# Altium schematic sheet B293A PSU.SchDoc: Power Supply
size A3; DocumentNumber: 293; Revision: A; PageSetup: Record=PageOptions|CenterHorizontal=True|CenterVertical=True|PrintScale=0.09|XCorrection=1.00|YCorrection=1.00|PrintKind=1|BorderSize=5000000|LeftOffset=0|BottomOffset=0|Orientation=2|PaperLength=1000|PaperWidth=1000|Scale=100|PaperSource=7|PrintQuality=-4|MediaType=1|DitherType=10|PaperKind=A3|PrintScaleMode=1
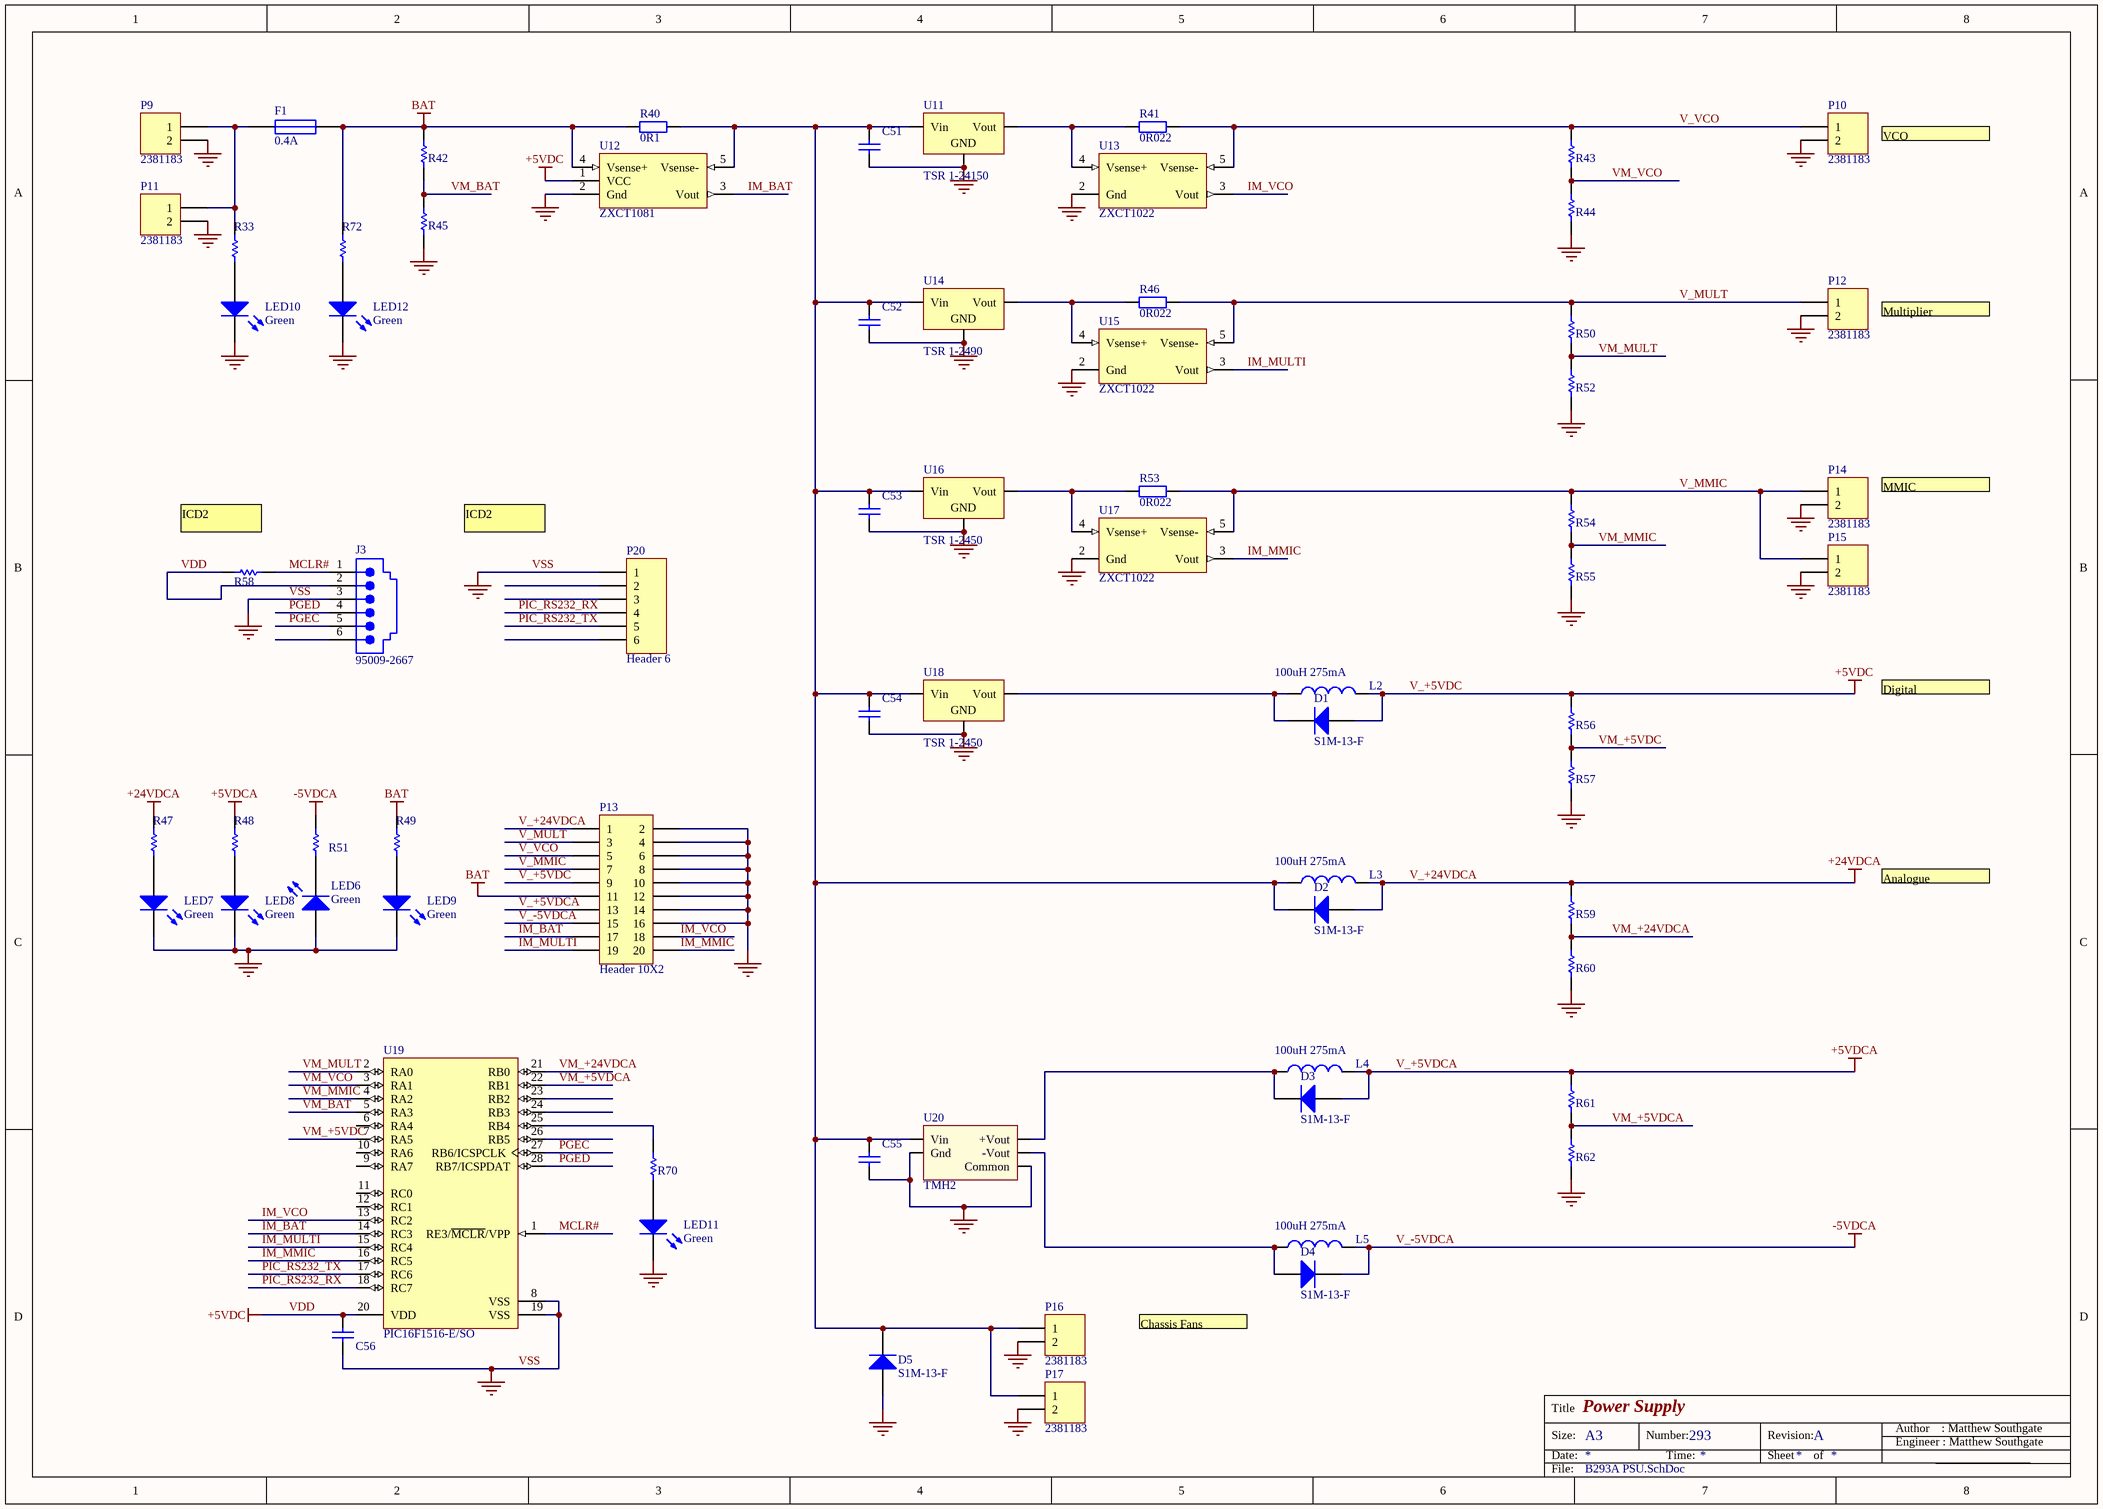
[diagram p0: B293A PSU.SchDoc]

## Parts
C51  CAP 10uF 25V 0805(2012)  [CAPC0805(2012)145_N]  (value not drawn)
C52  CAP 10uF 25V 0805(2012)  [CAPC0805(2012)145_N]  (value not drawn)
C53  CAP 10uF 25V 0805(2012)  [CAPC0805(2012)145_N]  (value not drawn)
C54  CAP 10uF 25V 0805(2012)  [CAPC0805(2012)145_N]  (value not drawn)
C55  CAP 10uF 25V 0805(2012)  [CAPC0805(2012)145_N]  (value not drawn)
C56  CAP 100nF 50V 0805(2012)  [CAPC0805(2012)100_M]  (value not drawn)
D1  S1M-13-F  [DIOD-S1M-13-F-SMA-2_V]
D2  S1M-13-F  [DIOD-S1M-13-F-SMA-2_V]
D3  S1M-13-F  [DIOD-S1M-13-F-SMA-2_V]
D4  S1M-13-F  [DIOD-S1M-13-F-SMA-2_V]
D5  S1M-13-F  [DIOD-S1M-13-F-SMA-2_V]
F1  0.4A  [RXEF040]
J3  95009-2667  [95009-2667]
L2  100uH 275mA  [AXIAL-0.4]
L3  100uH 275mA  [AXIAL-0.4]
L4  100uH 275mA  [AXIAL-0.4]
L5  100uH 275mA  [AXIAL-0.4]
LED6  Green  [1206 - LED]
LED7  Green  [1206 - LED]
LED8  Green  [1206 - LED]
LED9  Green  [1206 - LED]
LED10  Green  [1206 - LED]
LED11  Green  [1206 - LED]
LED12  Green  [1206 - LED]
P9  Supplier Part Number 1: 2381183  [MOLEX SL 2W Vertical with latch]  (hidden comment: MOLEX SL 2W VERT)
P10  Supplier Part Number 1: 2381183  [MOLEX SL 2W Vertical with latch]  (hidden comment: MOLEX SL 2W VERT)
P11  Supplier Part Number 1: 2381183  [MOLEX SL 2W Vertical with latch]  (hidden comment: MOLEX SL 2W VERT)
P12  Supplier Part Number 1: 2381183  [MOLEX SL 2W Vertical with latch]  (hidden comment: MOLEX SL 2W VERT)
P13  Header 10X2  [HDR2X10]
P14  Supplier Part Number 1: 2381183  [MOLEX SL 2W Vertical with latch]  (hidden comment: MOLEX SL 2W VERT)
P15  Supplier Part Number 1: 2381183  [MOLEX SL 2W Vertical with latch]  (hidden comment: MOLEX SL 2W VERT)
P16  Supplier Part Number 1: 2381183  [MOLEX SL 2W Vertical with latch]  (hidden comment: MOLEX SL 2W VERT)
P17  Supplier Part Number 1: 2381183  [MOLEX SL 2W Vertical with latch]  (hidden comment: MOLEX SL 2W VERT)
P20  Header 6  [HDR1X6]
R33  10K 5% 0805(2012)  [RESC0805(2012)_L]  (value not drawn)
R40  0R1  [1206]
R41  0R022  [1206]
R42  1K 5% 0805(2012)  [RESC0805(2012)_N]  (value not drawn)
R43  1K 5% 0805(2012)  [RESC0805(2012)_N]  (value not drawn)
R44  390R 5% 0805(2012)  [RESC0805(2012)_N]  (value not drawn)
R45  220R 5% 0805(2012)  [RESC0805(2012)_L]  (value not drawn)
R46  0R022  [1206]
R47  6K8 5% 0805(2012)  [RESC0805(2012)_L]  (value not drawn)
R48  1K 5% 0805(2012)  [RESC0805(2012)_N]  (value not drawn)
R49  10K 5% 0805(2012)  [RESC0805(2012)_L]  (value not drawn)
R50  1K 5% 0805(2012)  [RESC0805(2012)_N]  (value not drawn)
R51  1K 5% 0805(2012)  [RESC0805(2012)_N]  (value not drawn)
R52  1K 5% 0805(2012)  [RESC0805(2012)_N]  (value not drawn)
R53  0R022  [1206]
R54  1K 5% 0805(2012)  [RESC0805(2012)_N]  (value not drawn)
R55  10K 5% 0805(2012)  [RESC0805(2012)_L]  (value not drawn)
R56  1K 5% 0805(2012)  [RESC0805(2012)_N]  (value not drawn)
R57  10K 5% 0805(2012)  [RESC0805(2012)_L]  (value not drawn)
R58  10K 5% 0805(2012)  [RESC0805(2012)_L]  (value not drawn)
R59  1K 5% 0805(2012)  [RESC0805(2012)_N]  (value not drawn)
R60  220R 5% 0805(2012)  [RESC0805(2012)_L]  (value not drawn)
R61  1K 5% 0805(2012)  [RESC0805(2012)_N]  (value not drawn)
R62  10K 5% 0805(2012)  [RESC0805(2012)_L]  (value not drawn)
R70  1K 5% 0805(2012)  [RESC0805(2012)_N]  (value not drawn)
R72  10K 5% 0805(2012)  [RESC0805(2012)_L]  (value not drawn)
U11  TSR 1-24150  [TSR-1 Series]
U12  ZXCT1081  [SOT23-5]
U13  ZXCT1022  [SOT23-5]
U14  TSR 1-2490  [TSR-1 Series]
U15  ZXCT1022  [SOT23-5]
U16  TSR 1-2450  [TSR-1 Series]
U17  ZXCT1022  [SOT23-5]
U18  TSR 1-2450  [TSR-1 Series]
U19  PIC16F1516-E/SO  [MCHP-SOIC-SO28_N]
U20  TMH2  [TMH2 Dual output]

## Nets
BAT: F1.2 P13.11 R40.2 R42.2 R49.2 R72.2 U12.4(Vsense+)
V_+5VDC: C56.1 D1.1(A) J3.2 L2.2 P13.9 R56.2 R58.1 U12.1(VCC) U19.20(VDD)  [also labelled +5VDC, VDD]
V_+5VDCA: D3.1(A) L4.2 P13.13 R48.2 R61.2  [also labelled +5VDCA]
V_+24VDCA: D2.1(A) L3.2 P13.1 R47.2 R59.2  [also labelled +24VDCA]
V_-5VDCA: D4.2(K) L5.2 P13.15 R51.1  [also labelled -5VDCA]
VSS: C51.1 C52.1 C53.1 C54.1 C55.1 C56.2 D5.1(A) J3.3 LED6.A LED7.K LED8.K LED9.K LED10.K LED11.K LED12.K P9.2 P10.2 P11.2 P12.2 P13.2 P13.4 P13.6 P13.8 P13.10 P13.12 P13.14 P13.16 P14.2 P15.2 P16.2 P17.2 P20.1 R44.1 R45.1 R52.1 R55.1 R57.1 R60.1 R62.1 U11.2(GND) U12.2(Gnd) U13.2(Gnd) U14.2(GND) U15.2(Gnd) U16.2(GND) U17.2(Gnd) U18.2(GND) U19.8(VSS) U19.19(VSS) U20.2(Gnd) U20.5(Common)  [also labelled GND]
IM_BAT: P13.17 U12.3(Vout) U19.14(RC3)
IM_MMIC: P13.20 U17.3(Vout) U19.16(RC5)
IM_MULTI: P13.19 U15.3(Vout) U19.15(RC4)
IM_VCO: P13.18 U13.3(Vout) U19.13(RC2)
MCLR#: J3.1 R58.2 U19.1(RE3/~{MCLR}/VPP)
PGEC: J3.5 U19.27(RB6/ICSPCLK)
PGED: J3.4 U19.28(RB7/ICSPDAT)
PIC_RS232_RX: P20.4 U19.18(RC7)
PIC_RS232_TX: P20.5 U19.17(RC6)
V_MMIC: P13.7 P14.1 P15.1 R53.2 R54.2 U17.5(Vsense-)
V_MULT: P12.1 P13.3 R46.2 R50.2 U15.5(Vsense-)
V_VCO: P10.1 P13.5 R41.2 R43.2 U13.5(Vsense-)
VM_+5VDC: R56.1 R57.2 U19.7(RA5)
VM_+5VDCA: R61.1 R62.2 U19.22(RB1)
VM_+24VDCA: R59.1 R60.2 U19.21(RB0)
VM_BAT: R42.1 R45.2 U19.5(RA3)
VM_MMIC: R54.1 R55.2 U19.4(RA2)
VM_MULT: R50.1 R52.2 U19.2(RA0)
VM_VCO: R43.1 R44.2 U19.3(RA1)
NetC51_2: C51.2 C52.2 C53.2 C54.2 C55.2 D2.2(K) D5.2(K) L3.1 P16.1 P17.1 R40.1 U11.1(Vin) U12.5(Vsense-) U14.1(Vin) U16.1(Vin) U18.1(Vin) U20.1(Vin)
NetD1_2: D1.2(K) L2.1 U18.3(Vout)
NetD3_2: D3.2(K) L4.1 U20.6(+Vout)
NetD4_1: D4.1(A) L5.1 U20.4(-Vout)
NetF1_1: F1.1 P9.1 P11.1 R33.2
NetLED6_K: LED6.K R51.2
NetLED7_A: LED7.A R47.1
NetLED8_A: LED8.A R48.1
NetLED9_A: LED9.A R49.1
NetLED10_A: LED10.A R33.1
NetLED11_A: LED11.A R70.1
NetLED12_A: LED12.A R72.1
NetR41_1: R41.1 U11.3(Vout) U13.4(Vsense+)
NetR46_1: R46.1 U14.3(Vout) U15.4(Vsense+)
NetR53_1: R53.1 U16.3(Vout) U17.4(Vsense+)
NetR70_2: R70.2 U19.25(RB4)

Not connected (* = marked no-connect by the designer): J3 6; P20 2 3 6; U19 6(RA4) 9(RA7) 10(RA6) 11(RC0) 12(RC1) 23(RB2) 24(RB3) 26(RB5)

## Notes on the sheet
- VCO
- Multiplier
- MMIC
- (near R58) ICD2
- ICD2
- Digital
- Analogue
- Chassis Fans
- Title
- Size:
- Date:
- A3
- Number:
- Time:
- Revision:
- Sheet
- of
- Engineer : Matthew Southgate
- Author    : Matthew Southgate
- File:

## Library data of the parts
C51-C55 = CMP-1036-04933-1: CAP 10uF 25V ±20% 0805 (2012 Metric) Thickness 1.45mm SMD; Case-EIA: 0805; Case-Metric: 2012; Technology: SMT; Tolerance: ±20%; Max Thickness: 1.45 mm; Value: 10uF; Rated Voltage: 25 V
C56 = CMP-1036-04423-1: CAP 100nF 50V ±20% 0805 (2012 Metric) Thickness 1mm SMD; Case-Metric: 2012; Case-EIA: 0805; Value: 100nF; Max Thickness: 1 mm; Rated Voltage: 50 V; Tolerance: ±20%; Technology: SMT
D1-D5 = CMP-0639-00001-1: Surface Mount Glass Passivated Rectifier, 1000V, 1 A, -65 to 125 degC, 2-Pin SMA Package, RoHS, Tape and Reel; Manufacturer: Diodes Inc; DatasheetVersion: Rev. 22 - 2; PackageReference: S1M-13-F-SMA-2; PackageDescription: 2-Pin SMD, Body 4.3 x 2.605 mm, Height 2.3 mm; ComponentLink1Description: Manufacturer URL; ComponentLink1URL: http://www.diodes.com/; ComponentLink2Description: Datasheet; ComponentLink2URL: http://diodes.com/datasheets/ds16003.pdf; ComponentLink3URL: http://diodes.com/datasheets/ds16003.pdf; ComponentLink3Description: Package Specification; Mounting Technology: Surface Mount; RoHS: TRUE; Packing: Tape and Reel; PackageVersion: Rev. 22 - 2; PartNumber: S1M-13-F
F1 = Fuse Poly 0.4A: POLYSWITCH, RADIAL, 0.4A; Manufacturer: TE CONNECTIVITY / RAYCHEM; Description: TE CONNECTIVITY / RAYCHEM - RXEF040 - POLYSWITCH, RADIAL, 0.4A; Holding Current: 400; Tripping Current: 800; Initial Resistance Max: 0.86; Operating Voltage: 72; PTC Fuse Case: Radial Leaded; Supplier: Farnell; Supplier Order Code: 1175862; Manufacturer Part Number: RXEF040; Supplier 1: Farnell; Supplier Part Number 1: 1175862; RoHS: YES; Stock 1: 8252; Pricing 1: 5=0.31, 50=0.25, 100=0.197, 250=0.187, 500=0.139, 1000=0.129 (GBP); ComponentLink1URL: http://www.farnell.com/datasheets/1482689.pdf; ComponentLink1Description: http://www.farnell.com/datasheets/1482689.pdf; Supplier 2: Newark; Supplier Part Number 2: 04H8116; Stock 2: 1314; Pricing 2: 1=0.388, 10=0.366, 100=0.332, 500=0.259, 1000=0.223, 5000=0.205, 10000=0.173, 50000=0.166 (USD); Series: RXE; Fuse Terminals: Radial Leaded; Lead Spacing: 5.8; ComponentLink2URL: http://www.te.com/commerce/DocumentDelivery/DDEController?Action=showdoc&DocId=Catalog+Section%7FRADIAL-LEADED%7FA%7Fpdf%7FEnglish%7FENG_CS_RADIAL-LEADED_A.pdf%7FRF0417-000; ComponentLink2Description: http://www.te.com/commerce/DocumentDelivery/DDEController?Action=showdoc&DocId=Catalog+Section%7FRADIAL-LEADED%7FA%7Fpdf%7FEnglish%7FENG_CS_RADIAL-LEADED_A.pdf%7FRF0417-000
J3 = 95009-2667: Right Angle, Standard Profile, Flush Mount PCB Jack; Manufacturer: MOLEX; Ports: 1; Positions/Loaded: Port1 - 6/6; PerformanceCategory: 3; PCB_Mounting: Thru-Hole; DrillSize: Nominal, Rounded to nearest 0.05mm; PCB_Layout: Complies with Manufacturer's Recommendation.; Description: MOLEX - 95009-2667 - JACK PLUG; Published: 25-Jun-2002; DatasheetDocument: 18-Dec-2001; PackageDocument: 18-Dec-2001; PackageReference: 95009-2667; Publisher: Altium Limited; ComponentLink1Description: Manufacturer Link; ComponentLink1URL: http://www.molex.com/; Supplier 1: Farnell; Supplier Part Number 1: 1393306; Manufacturer Part Number: 95009-2667; RoHS: YES; Stock 1: 159; Pricing 1: 5=0.85, 100=0.52, 250=0.42, 500=0.41, 1000=0.38, 2500=0.34, 2500=0.306, 20000=0.275 (GBP); ComponentLink2URL: http://www.farnell.com/cad/1597831.pdf; ComponentLink2Description: http://www.farnell.com/cad/1597831.pdf; ComponentLink3URL: http://www.farnell.com/datasheets/1627656.pdf; ComponentLink3Description: http://www.farnell.com/datasheets/1627656.pdf; Supplier 2: Newark; Supplier Part Number 2: 60H6049; Stock 2: 0; ComponentLink4URL: http://www.farnell.com/datasheets/1025072.pdf; ComponentLink4Description: http://www.farnell.com/datasheets/1025072.pdf; ComponentLink5URL: http://www.molex.com/pdm_docs/sd/950092667_sd.pdf; ComponentLink5Description: http://www.molex.com/pdm_docs/sd/950092667_sd.pdf
L2-L5 = Inductor: Power Inductor; Manufacturer Part Number: MCAL0410A1-101KU; Manufacturer: MULTICOMP; Order Code: 1864497; Fitted: Yes; RoHS Compliant: TRUE; Supplier: Farnell
LED6-LED12 = LED 1206 GREEN: LED, SMD, 1206, CLR LENS, GREEN; Manufacturer Part Number: KPC-3216SGC; Manufacturer: KINGBRIGHT; Order Code: 1318254; Supplier: Farnell; Supplier 1: Farnell; RoHS: YES; Stock 1: 798; Pricing 1: 10=0.2, 50=0.169, 100=0.146, 250=0.126, 500=0.119, 1000=0.107, 1000=0.0964, 8000=0.0868 (GBP); ComponentLink1URL: http://www.us.kingbright.com/images/catalog/SPEC/APC3216SGC.pdf; ComponentLink1Description: http://www.us.kingbright.com/images/catalog/SPEC/APC3216SGC.pdf; Supplier Part Number 1: 1318254
P9-P12 P14-P17 = MOLEX SL 2W VERT: MOLEX - 70543-0106 - CONNECTOR, HEADER, 2POS, 1ROW, 2.54MM; Product Range: MOLEX - SL 70543 Series; Contact Termination: Through Hole Vertical; No. of Contacts: 2; No. of Rows: 1; Pitch Spacing: 2.54; Supplier: Farnell; Order Code: 2381183; Manufacturer Part Number: 70543-0106; Supplier 1: Farnell; Manufacturer: MOLEX; RoHS: YES; Stock 1: 3355; Pricing 1: 5=0.414, 10=0.373, 100=0.336, 500=0.302, 1000=0.272, 2500=0.245 (GBP); Gender: Header; Contact Plating: Gold; Contact Material: Phosphor Bronze<!--FANDB--><div class="features-and-benefits-container"></div>; ComponentLink1URL: http://www.farnell.com/cad/1728429.pdf; ComponentLink1Description: http://www.farnell.com/cad/1728429.pdf
P13 = Header 10X2: Header, 10-Pin, Dual row; LatestRevisionDate: 17-Jul-2002; LatestRevisionNote: Re-released for DXP Platform.; Publisher: Altium Limited
P20 = Header 6: Header, 6-Pin; LatestRevisionDate: 17-Jul-2002; LatestRevisionNote: Re-released for DXP Platform.; Publisher: Altium Limited
R33 R49 R55 R57 R58 R62 R72 = CMP-1013-00098-1: 10K 0.125W 5% 0805 (2012 Metric)  SMD; Case-Metric: 2012; Value: 10000.00 Ohm; Case-EIA: 0805; Technology: SMT; Tolerance: 5 %; Power: 0.125 W
R40 = RES_0R1: RESISTOR, THICK, 0.1OHM, 0.25W, 1%, 1206; Manufacturer Part Number: CRL1206-FW-R100ELF; Order Code: 2008301; Supplier: Farnell
R41 R46 R53 = RES_0R022: RESISTOR, CURRENT SENSE, 0R022, 0.5W, 1%; Manufacturer: MULTICOMP; Manufacturer Part Number: MCCSM06FTDUR022; Order Code: 2294085; Description: MULTICOMP - MCCSM06FTDUR022 - RESISTOR, CURRENT SENSE, 0R022, 0.5W, 1%; Supplier: Farnell; Supplier 1: Farnell; Supplier Part Number 1: 2294085; RoHS: YES; Stock 1: 4260; Pricing 1: 10=0.165, 50=0.136, 100=0.125, 500=0.113, 1000=0.102 (GBP); ComponentLink1URL: http://www.farnell.com/datasheets/1691440.pdf; ComponentLink1Description: http://www.farnell.com/datasheets/1691440.pdf
R42 R43 R48 R50-R52 R54 R56 R59 R61 R70 = CMP-1013-00074-1: 1K 0.125W 5% 0805 (2012 Metric)  SMD; Case-Metric: 2012; Case-EIA: 0805; Value: 1000.00 Ohm; Power: 0.125 W; Tolerance: 5 %; Technology: SMT
R44 = CMP-1013-00064-1: 390R 0.125W 5% 0805 (2012 Metric)  SMD; Case-EIA: 0805; Value: 390.00 Ohm; Case-Metric: 2012; Technology: SMT; Tolerance: 5 %; Power: 0.125 W
R45 R60 = CMP-1013-00058-1: 220R 0.125W 5% 0805 (2012 Metric)  SMD; Value: 220.00 Ohm; Case-EIA: 0805; Case-Metric: 2012; Tolerance: 5 %; Technology: SMT; Power: 0.125 W
R47 = CMP-1013-00094-1: 6K8 0.125W 5% 0805 (2012 Metric)  SMD; Value: 6800.00 Ohm; Case-EIA: 0805; Case-Metric: 2012; Power: 0.125 W; Technology: SMT; Tolerance: 5 %
U11 = TSR-1 Series DC-DC 15V: CONVERTER, DC TO DC, 24V TO 15V, 15W; Manufacturer: TRACOPOWER; Order Code: 1672131; Description: TRACOPOWER - TSR 1-24150 - CONVERTER, DC TO DC, 24V TO 15V, 15W; DC / DC Converter Type: Non Isolated POL; DC / DC Converter Mounting: Through Hole; Input Voltage DC Min: 18; Input Voltage DC Max: 36; No. of Outputs: 1; Output Voltage Nom.: 15; DC / DC Converter Output Type: Fixed<!--FANDB--><div class="features-and-benefits-container"></div>; Supplier: Farnell; Supplier 1: Farnell; Supplier Part Number 1: 1672131; Manufacturer Part Number: TSR 1-24150; RoHS: YES; Stock 1: 405; Pricing 1: 1=6.6, 5=6.4, 10=6.21, 25=6.02 (GBP); Output Current Max: 1; Output Power Max: 15; Depth: 11.7; Width: 7.6; Height: 10.2; Approvals / Standards: -; ComponentLink1URL: http://www.farnell.com/datasheets/1537625.pdf; ComponentLink1Description: http://www.farnell.com/datasheets/1537625.pdf; ComponentLink2URL: http://www.farnell.com/datasheets/1763604.pdf; ComponentLink2Description: http://www.farnell.com/datasheets/1763604.pdf; ComponentLink3URL: http://www.tracopower.com/fileadmin/medien/dokumente/pdf/datasheets/tsr1.pdf; ComponentLink3Description: http://www.tracopower.com/fileadmin/medien/dokumente/pdf/datasheets/tsr1.pdf
U12 = ZXCT1081: CURRENT MONITOR, PRECISION, 40V; Mancufacturer Part Number: ZXCT1081E5TA; Manufacturer: DIODES INC.; Order Code: 1461568; Description: DIODES INC. - ZXCT1081E5TA - CURRENT MONITOR, PRECISION, 40V; Supplier: Farnell; Supplier 1: Farnell; Supplier Part Number 1: 1461568; Manufacturer Part Number: ZXCT1081E5TA; RoHS: YES; Stock 1: 4400; Pricing 1: 1=1.1, 10=0.8, 100=0.7, 250=0.62, 500=0.419, 2000=0.415, 2000=0.407, 10000=0.399 (GBP); ComponentLink1URL: http://www.farnell.com/datasheets/5927.pdf; ComponentLink1Description: http://www.farnell.com/datasheets/5927.pdf
U13 U15 U17 = ZXCT1022: Manufacturer: DIODES INC.; Manufacturer Part Number: ZXCT1022E5TA; Description: DIODES INC. - ZXCT1022E5TA - CURRENT MONITOR, HIGH SIDE, 1022; Supplier 1: Farnell; Supplier Part Number 1: 1461563; RoHS: YES; Stock 1: 1028; Pricing 1: 1=0.87, 10=0.66, 100=0.54, 250=0.52, 500=0.49, 2000=0.373, 2000=0.366, 20000=0.359 (GBP); ComponentLink1URL: http://www.farnell.com/datasheets/5923.pdf; ComponentLink1Description: http://www.farnell.com/datasheets/5923.pdf
U14 = TSR-1 Series DC-DC 9V: DC/DC CONVERTER, 9V, 1A,; Manufacturer: TRACOPOWER; Order Code: 1696322; Description: TRACOPOWER - TSR 1-2490 - DC/DC CONVERTER, 9V, 1A, STEP DOWN; Supplier: Farnell; Supplier 1: Farnell; Supplier Part Number 1: 1696322; Manufacturer Part Number: TSR 1-2490; RoHS: YES; Stock 1: 864; Pricing 1: 1=6.6, 5=6.4, 10=6.21, 25=6.02 (GBP); ComponentLink1URL: http://www.farnell.com/datasheets/1537625.pdf; ComponentLink1Description: http://www.farnell.com/datasheets/1537625.pdf; ComponentLink2URL: http://www.farnell.com/datasheets/1763604.pdf; ComponentLink2Description: http://www.farnell.com/datasheets/1763604.pdf; ComponentLink3URL: http://www.tracopower.com/fileadmin/medien/dokumente/pdf/datasheets/tsr1.pdf; ComponentLink3Description: http://www.tracopower.com/fileadmin/medien/dokumente/pdf/datasheets/tsr1.pdf; Supplier 2: Newark; Supplier Part Number 2: 86P6890; Stock 2: 0; Pricing 2: 1=13.24, 5=12.73, 10=12.38, 25=11.81, 50=11.12 (USD)
U16 U18 = TSR-1 Series DC-DC 5V: CONVERTER, DC/DC, 5V, 1A, SIP; Manufacturer: TRACOPOWER; Order Code: 1696320; Description: TRACOPOWER - TSR 1-2450 - CONVERTER, DC/DC, 5V, 1A, SIP; DC / DC Converter Type: Non Isolated POL; DC / DC Converter Mounting: Through Hole; Input Voltage DC Min: 6.5; Input Voltage DC Max: 36; No. of Outputs: 1; Supplier: Farnell; Supplier 1: Farnell; Supplier Part Number 1: 1696320; Manufacturer Part Number: TSR 1-2450; RoHS: YES; Stock 1: 9547; Pricing 1: 1=4.8, 5=4.66, 10=4.52, 25=4.38 (GBP); ComponentLink1URL: http://www.farnell.com/datasheets/1537625.pdf; ComponentLink1Description: http://www.farnell.com/datasheets/1537625.pdf; ComponentLink2URL: http://www.farnell.com/datasheets/1763604.pdf; ComponentLink2Description: http://www.farnell.com/datasheets/1763604.pdf; ComponentLink3URL: http://www.tracopower.com/fileadmin/medien/dokumente/pdf/datasheets/tsr1.pdf; ComponentLink3Description: http://www.tracopower.com/fileadmin/medien/dokumente/pdf/datasheets/tsr1.pdf; Supplier 2: Newark; Supplier Part Number 2: 08R5932; Stock 2: 410; Pricing 2: 1=9.42, 5=9.05, 10=8.81, 25=8.4, 50=7.91 (USD); Output Current Max: 1; Depth: 11.7; ComponentLink4URL: http://www.tracopower.com/products/tsr1.pdf; ComponentLink4Description: http://www.tracopower.com/products/tsr1.pdf
U19 = CMP-0115-02502-1: Flash Microcontroller with XLP Technology, 20 MHz, 24 I/O, -40 to 125 degC, 28-pin SOIC (SO28), Tube; Manufacturer: Microchip; Digital Communication: 1 -A/E/USART, 1 -MSSP(SPI/I2C); I/O Pins: 24; # of A/D Channels: 17; Program Memory KWords: 8; RAM: 512; Max. CPU Speed MHz: 20; Program Memory KBytes: 14; Operation Voltage Range: 2.3V - 5.5V; Timers: 2 - 8-bit, 1 - 16-bit; Internal Oscillator: 16 MHz, 32 kHz; Packing: TUBE; ComponentLink2URL: http://www.microchip.com/stellent/groups/techpub_sg/documents/packagingspec/en012702.pdf; ComponentLink2Description: Package Specification; PackageDescription: 28-Lead Plastic Small Outline, 17.9 x 7.5 mm Body, 1.27 mm Pitch; ComponentLink1Description: Datasheet; Mounting Technology: Surface Mount; RoHS: TRUE; ComponentLink1URL: http://ww1.microchip.com/downloads/en/DeviceDoc/41452C.pdf; PackageVersion: C04-052C, 12/2012; Memory Type: Flash; DatasheetVersion: Rev. C; PartNumber: PIC16F1516-E/SO; ComponentLink3URL: Product URL:http://www.microchip.com/datasheet/PIC16F1516; PackageReference: SOIC-SO28; ComponentLink3Description: URL Link1
U20 = TMH2 Series Dual DC-DC: Isolated output; Manufacturer: TRACOPOWER; Manufacturer Part Number: TMH 2405D; Description: TRACOPOWER - TMH 2405D - CONVERTER, DC/DC, 2W, +/-5V/0.2A; Supplier 1: Farnell; Supplier Part Number 1: 1007568; RoHS: YES; Stock 1: 46; Pricing 1: 1=5.95, 5=5.77, 10=5.6, 25=5.43 (GBP); ComponentLink1URL: http://www.farnell.com/datasheets/1537625.pdf; ComponentLink1Description: http://www.farnell.com/datasheets/1537625.pdf; ComponentLink2URL: http://www.farnell.com/datasheets/1648746.pdf; ComponentLink2Description: http://www.farnell.com/datasheets/1648746.pdf; Supplier 2: Newark; Supplier Part Number 2: 51R5345; Stock 2: 8; Pricing 2: 1=7.84, 5=7.84, 10=7.84, 25=7.84, 50=6.72 (USD); ComponentLink3URL: http://www.tracopower.com/fileadmin/medien/dokumente/pdf/datasheets/tmh.pdf; ComponentLink3Description: http://www.tracopower.com/fileadmin/medien/dokumente/pdf/datasheets/tmh.pdf